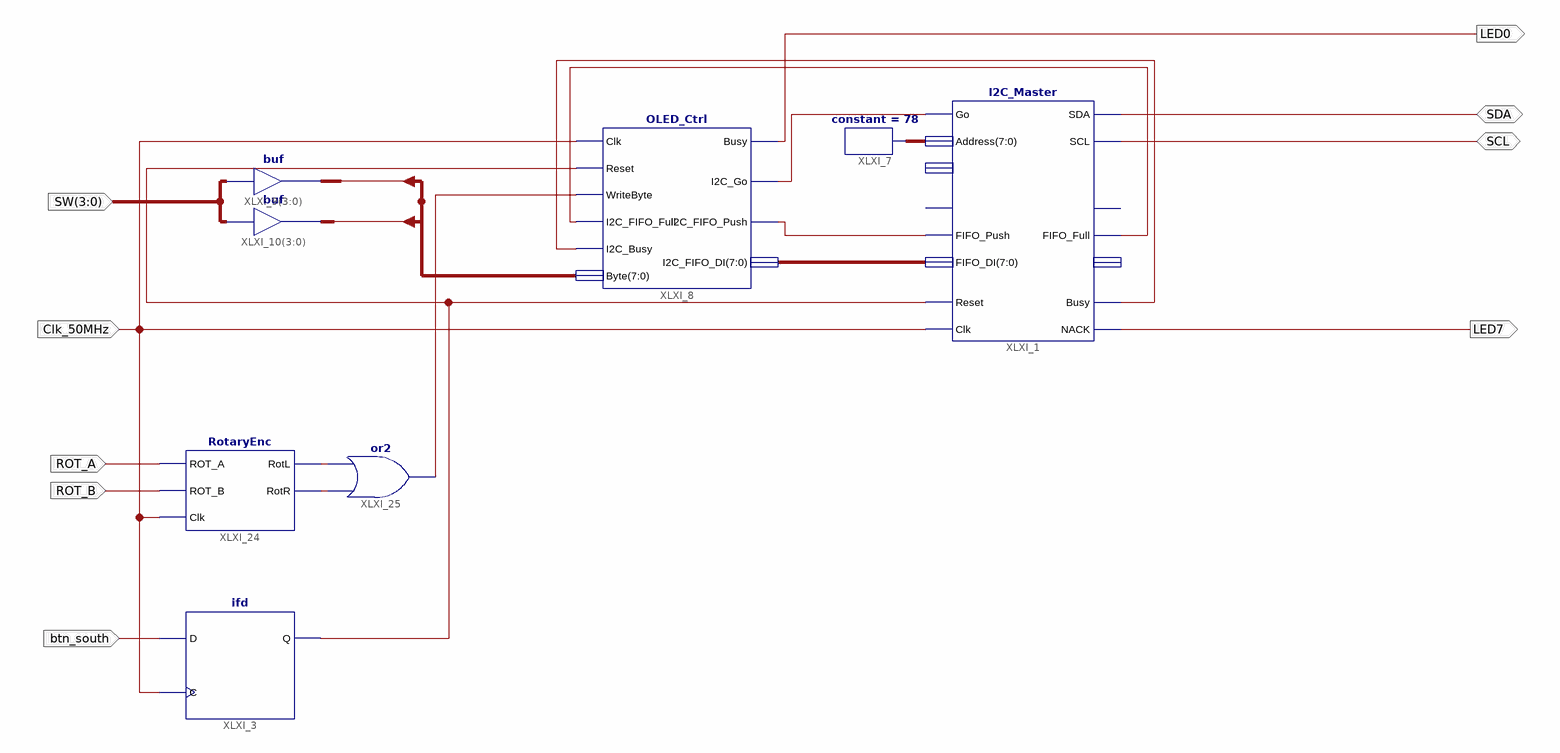
[diagram p0: schematic sheet 1]
// Xilinx ISE schematic top.sch (spartan3e) as structural Verilog: 8 symbols, 9 ports
module top (
  input  btn_south,
  input  [3:0] SW,
  input  ROT_B,
  input  ROT_A,
  input  Clk_50MHz,
  inout  SDA,
  inout  SCL,
  output LED7,
  output LED0
);

  wire XLXN_176, XLXN_177, XLXN_195, XLXN_196, XLXN_224, XLXN_226, XLXN_228, XLXN_232;
  wire [7:0] Byte, XLXN_95, XLXN_198;

  constant #(.CValue("78")) XLXI_7 (.O(XLXN_95));
  I2C_Master XLXI_1 (
    .Go(XLXN_195), .Address(XLXN_95), .SDA(SDA), .SCL(SCL), .FIFO_Push(XLXN_196), .FIFO_DI(XLXN_198),
    .FIFO_Full(XLXN_228), .Reset(XLXN_224), .Clk(Clk_50MHz), .Busy(XLXN_232), .NACK(LED7));  // open: ReadCnt, FIFO_Pop, FIFO_Empty, FIFO_DO
  OLED_Ctrl XLXI_8 (
    .Clk(Clk_50MHz), .Reset(XLXN_224), .WriteByte(XLXN_226), .I2C_FIFO_Full(XLXN_228), .I2C_Busy(XLXN_232),
    .Byte(Byte), .Busy(LED0), .I2C_Go(XLXN_195), .I2C_FIFO_Push(XLXN_196), .I2C_FIFO_DI(XLXN_198));
  ifd XLXI_3 (.C(Clk_50MHz), .D(btn_south), .Q(XLXN_224));
  assign Byte[3:0] = SW;  // buf XLXI_10[3..0], 4 bits wide
  assign Byte[7:4] = SW;  // buf XLXI_9[3..0], 4 bits wide
  RotaryEnc XLXI_24 (.ROT_A(ROT_A), .ROT_B(ROT_B), .RotL(XLXN_177), .RotR(XLXN_176), .Clk(Clk_50MHz));
  or XLXI_25 (XLXN_226, XLXN_176, XLXN_177);
endmodule
